# Altium project PCB_Project_Encoder_Addon.PrjPcb
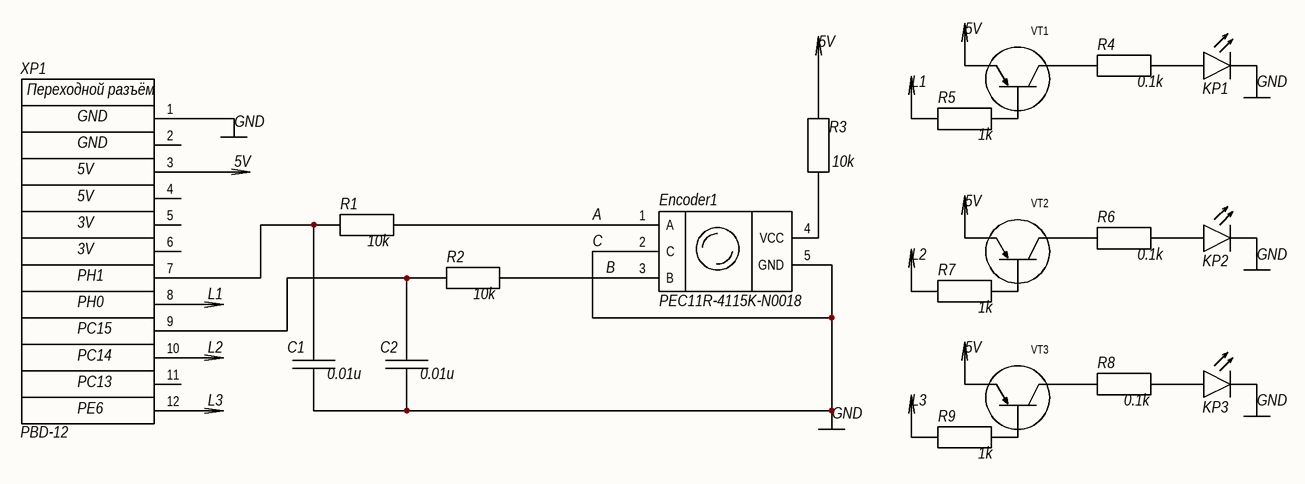
[diagram p0: Sheet1.SchDoc]
1 sheet, 35 parts. Net scope: global (net labels, ports and power ports of the same name join across sheets).
Board file: PCB1.PcbDoc

## Sheet Sheet1.SchDoc
size 420 x 297 mm; Address1: Address1; Address2: Address2; Address3: Address3; Address4: Address4; DocumentNumber: АБВГ.123456.001 Э3; SheetNumber: 1; Scale: 1:1; DocumentType: Схема электрическая принципиальная; FirstReferrence: АБВГ.123456.001

### Parts
(Parts that share a designator on the sheet are numbered #1, #2 ... from top to bottom, then left to right.)
C1  0.01u  [Cap 0805]
C2  0.01u  [Cap 0805]
Encoder1  PEC11R-4115K-N0018  [PEC11R-4115K-N0018]
GND#1  Ground  (value not drawn)  (graphical)
GND#2  Ground  (value not drawn)  (graphical)
GND#3  Ground  (value not drawn)  (graphical)
GND#4  Ground  (value not drawn)  (graphical)
GND#5  Ground  (value not drawn)  (graphical)
KP1  light  [KP LD RED]  (value not drawn)
KP2  light  [KP LD RED]  (value not drawn)
KP3  light  [L-813SRC-B]  (value not drawn)
Power#1  Power  (value not drawn)  (graphical)
Power#2  Power  (value not drawn)  (graphical)
Power#3  Power  (value not drawn)  (graphical)
Power#4  Power  (value not drawn)  (graphical)
Power#5  Power  (value not drawn)  (graphical)
Power#6  Power  (value not drawn)  (graphical)
Power#7  Power  (value not drawn)  (graphical)
Power#8  Power  (value not drawn)  (graphical)
Power#9  Power  (value not drawn)  (graphical)
Power#10  Power  (value not drawn)  (graphical)
Power#11  Power  (value not drawn)  (graphical)
R1  10k  [Res 0805]
R2  10k  [Res 0805]
R3  10k  [Res 0805]
R4  0.1k  [Res 0805]
R5  1k  [Res 0805]
R6  0.1k  [Res 0805]
R7  1k  [Res 0805]
R8  0.1k  [Res 0805]
R9  1k  [Res 0805]
VT1  bipolar_pnp  [SOT-23]  (value not drawn)
VT2  bipolar_pnp  [SOT-23]  (value not drawn)
VT3  bipolar_pnp  [SOT-23]  (value not drawn)
XP1  PBD-12  [PBD-12]

### Nets
5V: Power#1.1 Power#2.1 Power#4.1 Power#5.1 Power#9.1 R3.1 VT1.2 VT2.2 VT3.2 XP1.3
A: Encoder1.1(A) R1.2
B: Encoder1.3(B) R2.2
C: C1.2 C2.2 Encoder1.2(C) Encoder1.5(GND) GND#1.1 GND#2.1 GND#3.1 GND#4.1 GND#5.1 KP1.2 KP2.2 KP3.2 XP1.1  [also labelled GND]
L1: Power#3.1 Power#7.1 R5.1 XP1.8
L2: Power#6.1 Power#8.1 R7.1 XP1.10
L3: Power#10.1 Power#11.1 R9.1 XP1.12
NetC1_1: C1.1 R1.1 XP1.7
NetC2_1: C2.1 R2.1 XP1.9
NetEncoder1_4: Encoder1.4(VCC) R3.2
NetKP1_1: KP1.1 R4.2
NetKP2_1: KP2.1 R6.2
NetKP3_1: KP3.1 R8.2
NetR4_1: R4.1 VT1.3
NetR5_2: R5.2 VT1.1
NetR6_1: R6.1 VT2.3
NetR7_2: R7.2 VT2.1
NetR8_1: R8.1 VT3.3
NetR9_2: R9.2 VT3.1

Not connected (* = marked no-connect by the designer): XP1 2 4 5 6 11

### Notes on the sheet
- Перв. примен.
- Справ. №
- Подп. и дата
- Инв. № дубл.
- Взам. инв. №
- Разраб.
- Изм.
- Лист
- № докум.
- Подп.
- Дата
- Лит.
- Масса
- Масштаб
- Пров.
- Т.контр.
- Листов
- Инв. № подл.
- Утв.
- Н.контр.
- 2.106-A3
- Копировал
- Формат А3
- (in symbol PBD - 12) Переходной разъём; GND; 5V; 3V; PH1; PH0; PC15; PC14; PC13; PE6

### Library data of the parts
C1 C2 = Capacitor: Value: 0.01u
Encoder1 = ENCODER
R1-R9 = Resistor: HelpURL: *; Manufacture: *
  R1-R3: Value: 10k
  R4 R6 R8: Value: 0.1k
  R5 R7 R9: Value: 1k
XP1 = PBD - 12